# Altium schematic sheet Drive.SchDoc
size 420 x 297 mm; DocumentNumber: 2; SheetNumber: 11; SheetTotal: 14; PageSetup: Record=PageOptions|CenterHorizontal=True|CenterVertical=True|PrintScale=0.96|XCorrection=1.00|YCorrection=1.00|PrintKind=1|BorderSize=5000000|LeftOffset=0|BottomOffset=0|Orientation=2|PaperLength=4318|PaperWidth=2794|Scale=100|PaperSource=7|PrintQuality=600|MediaType=1|DitherType=10|PaperKind=11" x 17"|PrintScaleMode=1
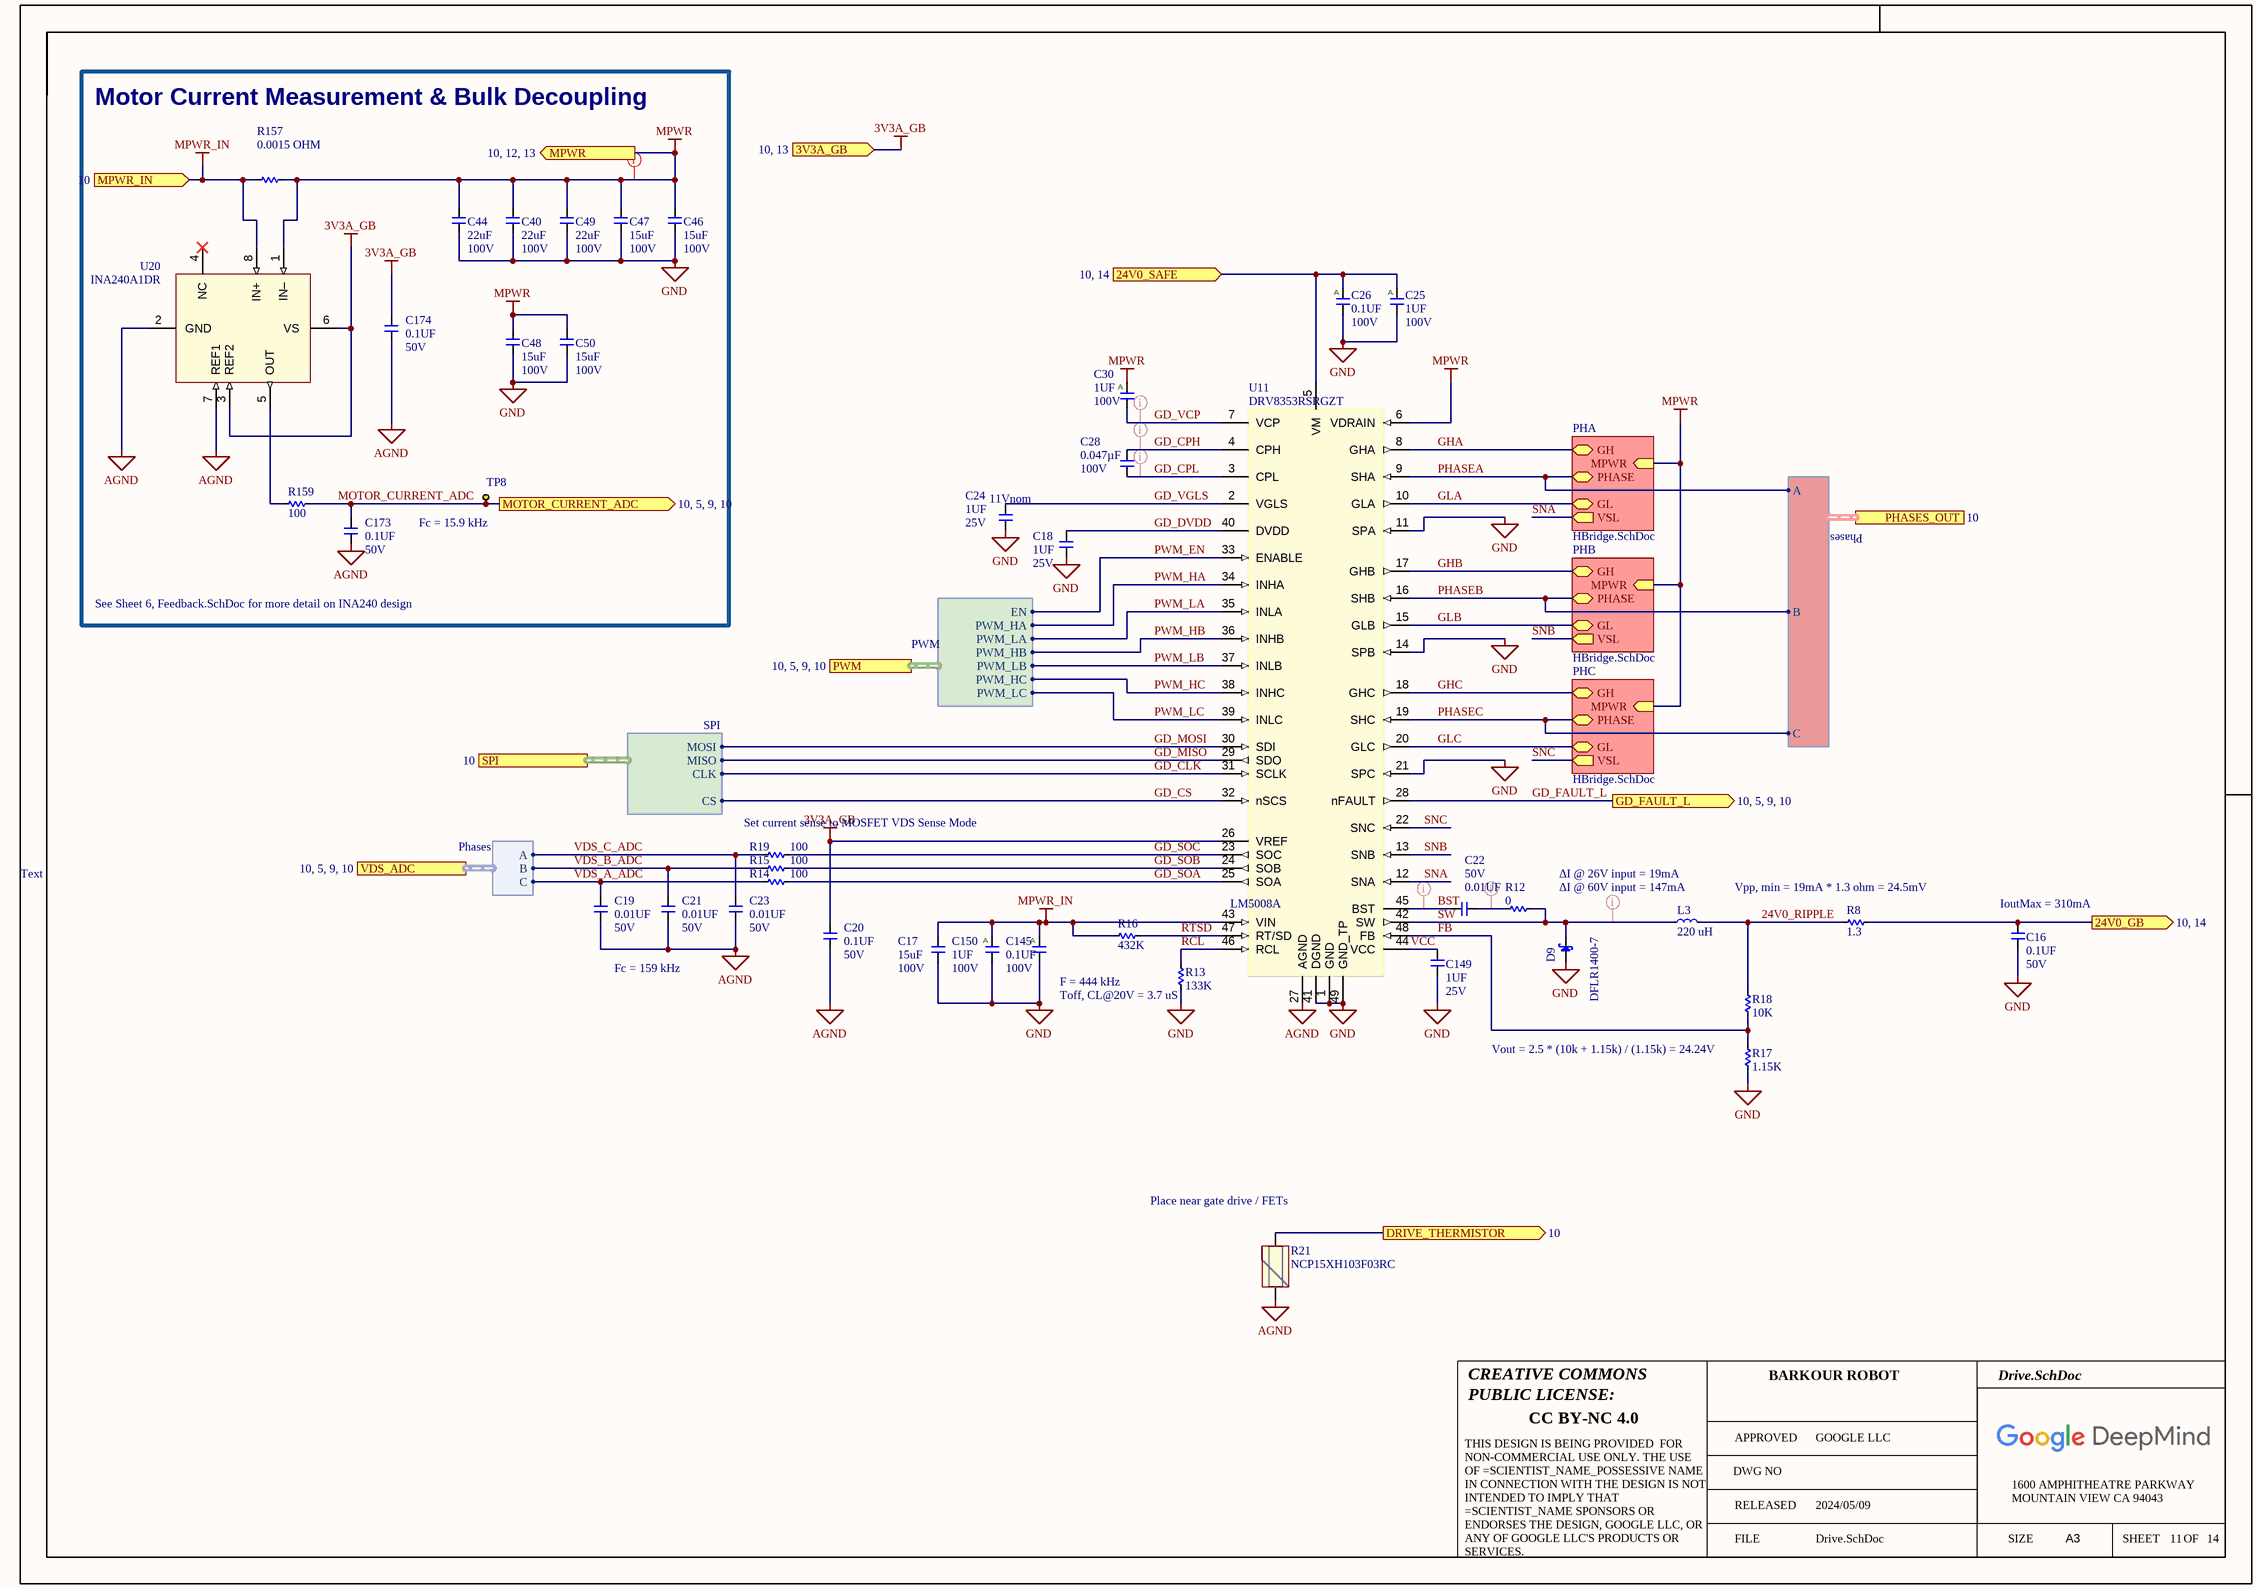
[diagram p0: Drive.SchDoc]

## Parts
C16  value 0.1UF  Voltage: 50V  [C0402]  (hidden comment: __Template_Cap)
C17  value 15uF  Voltage: 100V  [C2220]  (hidden comment: __Template_Cap)
C18  value 1UF  Voltage: 25V  [C0402]  (hidden comment: __Template_Cap)
C19  value 0.01UF  Voltage: 50V  [C0402]  (hidden comment: __Template_Cap)
C20  value 0.1UF  Voltage: 50V  [C0402]  (hidden comment: __Template_Cap)
C21  value 0.01UF  Voltage: 50V  [C0402]  (hidden comment: __Template_Cap)
C22  value 0.01UF  Voltage: 50V  [C0402]  (hidden comment: __Template_Cap)
C23  value 0.01UF  Voltage: 50V  [C0402]  (hidden comment: __Template_Cap)
C24  value 1UF  Voltage: 25V  [C0402]  (hidden comment: __Template_Cap)
C25  value 1UF  Voltage: 100V  [C0805]  (hidden comment: __Template_Cap_Auto)
C26  value 0.1UF  Voltage: 100V  [C0603]  (hidden comment: __Template_Cap_Auto)
C28  value 0.047µF  Voltage: 100V  [C0603]  (hidden comment: __Template_Cap)
C30  value 1UF  Voltage: 100V  [C0805]  (hidden comment: __Template_Cap_Auto)
C40  value 22uF  Voltage: 100V  [CAP_CKG57NX7S2A226M500JJ]  (hidden comment: __Template_Cap)
C44  value 22uF  Voltage: 100V  [CAP_CKG57NX7S2A226M500JJ]  (hidden comment: __Template_Cap)
C46  value 15uF  Voltage: 100V  [C2220]  (hidden comment: __Template_Cap)
C47  value 15uF  Voltage: 100V  [C2220]  (hidden comment: __Template_Cap)
C48  value 15uF  Voltage: 100V  [C2220]  (hidden comment: __Template_Cap)
C49  value 22uF  Voltage: 100V  [CAP_CKG57NX7S2A226M500JJ]  (hidden comment: __Template_Cap)
C50  value 15uF  Voltage: 100V  [C2220]  (hidden comment: __Template_Cap)
C145  value 0.1UF  Voltage: 100V  [C0603]  (hidden comment: __Template_Cap_Auto)
C149  value 1UF  Voltage: 25V  [C0402]  (hidden comment: __Template_Cap)
C150  value 1UF  Voltage: 100V  [C0805]  (hidden comment: __Template_Cap_Auto)
C173  value 0.1UF  Voltage: 50V  [C0402]  (hidden comment: __Template_Cap)
C174  value 0.1UF  Voltage: 50V  [C0402]  (hidden comment: __Template_Cap)
D9  value DFLR1400-7  [POWERDI123_DFLS1100-7]  (hidden comment: __Template_Diode_Schottky_A/K)
L3  value 220 uH  [IND_74404054221]  (hidden comment: __Template_Inductor)
R8  1.3  [R0805]
R12  0  [R0402]
R13  133K  [R0402]
R14  100  [R0402]
R15  100  [R0402]
R16  432K  [R0402]
R17  1.15K  [R0402]
R18  10K  [R0402]
R19  100  [R0402]
R21  Mfg P/N: NCP15XH103F03RC  [R0402]  (hidden comment: __Template_Thermistor)
R157  0.0015 OHM  [R2512]
R159  100  [R0402]
TP8  TEST_KEYSTONE5015  [TP_KEYSTONE_5015]  (value not drawn)
U11  MFG P/N: DRV8353RSRGZT  [VQFN50P700X700X100-48-TP_TP-CUST_NO_VIAS]  (hidden comment: MOTOR_DRIVE_DRV8353RSRGZT)
U20  INA240A1DR  [TI SOIC-8 D0008A]

## Blocks framed on the sheet
Motor Current Measurement & Bulk Decoupling: C40 C44 C46-C50 C173 C174 R157 R159 TP8 U20

## Sub-sheets
PHA = HBridge.SchDoc: GL (bidir), GH (bidir), PHASE (bidir), MPWR (in), VSL (out)
PHB = HBridge.SchDoc: GL (bidir), GH (bidir), PHASE (bidir), MPWR (in), VSL (out)
PHC = HBridge.SchDoc: GL (bidir), GH (bidir), PHASE (bidir), MPWR (in), VSL (out)

## Ports
3V3A_GB (in, see 10, 13), 24V0_GB (out, see 10, 14), 24V0_SAFE (in, see 10, 14), DRIVE_THERMISTOR (out, see 10), GD_FAULT_L (out, see 10, 5, 9, 10), MOTOR_CURRENT_ADC (out, see 10, 5, 9, 10), MPWR (out, see 10, 12, 13), MPWR_IN (in, see 10), PHASES_OUT (harness Phases, see 10), PWM (harness PWM, see 10, 5, 9, 10), SPI (harness SPI, see 10), VDS_ADC (harness Phases, see 10, 5, 9, 10)

## Harnesses
Phases: A, B, C
SPI: CLK, CS, MOSI, MISO
PWM: EN, PWM_HA, PWM_LA, PWM_HB, PWM_LB, PWM_HC, PWM_LC

## Nets
3V3A_GB: C20.1 C174.1 U11.26(VREF) U20.3(REF2) U20.6(VS) ; port 3V3A_GB
AGND: C19.2 C20.2 C21.2 C23.2 C173.2 C174.2 R21.2 U11.27(AGND) U20.2(GND) U20.7(REF1)
GND: C16.2 C17.2 C18.2 C24.2 C25.2 C26.2 C40.2 C44.2 C46.2 C47.2 C48.2 C49.2 C50.2 C145.2 C149.2 C150.2 D9.A R13.1 R17.1 U11.1(GND) U11.11(SPA) U11.14(SPB) U11.21(SPC) U11.41(DGND) U11.49(GND_TP)
MPWR: C30.1 C40.1 C44.1 C46.1 C47.1 C48.1 C49.1 C50.1 R157.2 U11.6(VDRAIN) U20.1(IN–) ; port MPWR, sheet PHA/MPWR, sheet PHB/MPWR, sheet PHC/MPWR
MPWR_IN: C17.1 C145.1 C150.1 R16.1 R157.1 U11.43(VIN) U20.8(IN+) ; port MPWR_IN
24V0_GB: C16.1 R8.2 ; port 24V0_GB
24V0_RIPPLE: L3.2 R8.1 R18.2
24V0_SAFE: C25.1 C26.1 U11.5(VM) ; port 24V0_SAFE
BST: C22.1 U11.45(BST)
DRIVE_THERMISTOR: R21.1 ; port DRIVE_THERMISTOR
FB: R17.2 R18.1 U11.48(FB)
GD_CLK: U11.31(SCLK) ; port SPI.CLK
GD_CPH: C28.1 U11.4(CPH)
GD_CPL: C28.2 U11.3(CPL)
GD_CS: U11.32(nSCS) ; port SPI.CS
GD_DVDD: C18.1 U11.40(DVDD)
GD_FAULT_L: U11.28(nFAULT) ; port GD_FAULT_L
GD_MISO: U11.29(SDO) ; port SPI.MISO
GD_MOSI: U11.30(SDI) ; port SPI.MOSI
GD_SOA: R14.2 U11.25(SOA)
GD_SOB: R15.2 U11.24(SOB)
GD_SOC: R19.2 U11.23(SOC)
GD_VCP: C30.2 U11.7(VCP)
GD_VGLS: C24.1 U11.2(VGLS)
GHA: U11.8(GHA) ; sheet PHA/GH
GHB: U11.17(GHB) ; sheet PHB/GH
GHC: U11.18(GHC) ; sheet PHC/GH
GLA: U11.10(GLA) ; sheet PHA/GL
GLB: U11.15(GLB) ; sheet PHB/GL
GLC: U11.20(GLC) ; sheet PHC/GL
MOTOR_CURRENT_ADC: C173.1 R159.2 TP8.1 ; port MOTOR_CURRENT_ADC
PHASEA: U11.9(SHA) ; sheet PHA/PHASE, port PHASES_OUT.A
PHASEB: U11.16(SHB) ; sheet PHB/PHASE, port PHASES_OUT.B
PHASEC: U11.19(SHC) ; sheet PHC/PHASE, port PHASES_OUT.C
PWM_EN: U11.33(ENABLE) ; port PWM.EN
PWM_HA: U11.34(INHA) ; port PWM.PWM_HA
PWM_HB: U11.36(INHB) ; port PWM.PWM_HB
PWM_HC: U11.38(INHC) ; port PWM.PWM_HC
PWM_LA: U11.35(INLA) ; port PWM.PWM_LA
PWM_LB: U11.37(INLB) ; port PWM.PWM_LB
PWM_LC: U11.39(INLC) ; port PWM.PWM_LC
RCL: R13.2 U11.46(RCL)
RTSD: R16.2 U11.47(RT/SD)
SNA: U11.12(SNA) ; sheet PHA/VSL
SNB: U11.13(SNB) ; sheet PHB/VSL
SNC: U11.22(SNC) ; sheet PHC/VSL
SW: D9.K L3.1 R12.2 U11.42(SW)
VCC: C149.1 U11.44(VCC)
VDS_A_ADC: C19.1 R14.1 ; port VDS_ADC.C
VDS_B_ADC: C21.1 R15.1 ; port VDS_ADC.B
VDS_C_ADC: C23.1 R19.1 ; port VDS_ADC.A
NetC22_2: C22.2 R12.1
NetR159_1: R159.1 U20.5(OUT)

Not connected (* = marked no-connect by the designer): U20 4(NC)*

## Layout directives
net class HVSW: BST, GD_CPH, GD_CPL, GD_VCP, NetC22_2, SW
net class HV: MPWR

## Notes on the sheet
- (near TP8) Fc = 15.9 kHz
- 11Vnom
- See Sheet 6, Feedback.SchDoc for more detail on INA240 design
- (near U11) Set current sense to MOSFET VDS Sense Mode
- Text
- (near U11) LM5008A
- ΔI @ 26V input = 19mA
- ΔI @ 60V input = 147mA
- (near R8) Vpp, min = 19mA * 1.3 ohm = 24.5mV
- IoutMax = 310mA
- Fc = 159 kHz
- F = 444 kHz
- (near R13) Toff, CL@20V = 3.7 uS
- (near R17) Vout = 2.5 * (10k + 1.15k) / (1.15k) = 24.24V
- (near R21) Place near gate drive / FETs
- CREATIVE COMMONS
- PUBLIC LICENSE:
- BARKOUR ROBOT
- CC BY-NC 4.0
- APPROVED
- DWG NO
- GOOGLE LLC
- FILE
- RELEASED
- 2024/05/09
- SIZE
- 1600 AMPHITHEATRE PARKWAY
- MOUNTAIN VIEW CA 94043
- A3
- SHEET
- OF
- THIS DESIGN IS BEING PROVIDED  FOR NON-COMMERCIAL USE ONLY. THE USE OF =SCIENTIST_NAME_POSSESSIVE NAME IN CONNECTION WITH THE DESIGN IS NOT INTENDED TO IMPLY THAT =SCIENTIST_NAME SPONSORS OR ENDORSES THE DESIGN, GOOGLE LLC, OR ANY OF GOOGLE LLC'S PRODUCTS OR SERVICES.
- (in symbol 1039) A
- (in symbol 1093) A

## Library data of the parts
C16 C20 C173 C174 = 1762: CAP, CER, X5R, 0.1uF, 10%, 50V, 0402, 0.55mm; MFG: YAGEO; MFG P/N: CC0402KRX5R9BB104; Status: Released; Package: 0402; Supplier 1: Digi-Key; ComponentLink1URL: http://www.yageo.com/documents/recent/UPY-GPHC_X5R_4V-to-50V_25.pdf; Supplier Part Number 1: 311-3342-1-ND
C17 C46-C48 C50 = 207: CAP, CER, X7S, 15uF, 100V, 20%, 2220, 2.8mm T; MFG: TDK; MFG P/N: CKG57KX7S2A156M335JH; Status: Released; Package: 2220; Supplier 1: Mouser; ComponentLink1URL: https://www.mouser.com/ProductDetail/TDK/CKG57KX7S2A156M335JH?qs=xLDY6iXSiQZjzyWjP57ZVA%3D%3D; Supplier Part Number 1: 810-CKG57KX7S2A156MH
C18 C24 C149 = 1717: CAP, CER, X5R, 1uF, 10%, 25V, 0402; MFG: TDK; MFG P/N: C1005X5R1E105K050BC; COMMON: 150-01202-00; Status: Released; Package: 0402; Supplier 1: Digi-Key; ComponentLink1URL: https://product.tdk.com/info/en/catalog/datasheets/mlcc_commercial_general_en.pdf; Supplier Part Number 1: 445-9066-1-ND
C19 C21-C23 = 625: CAP, CER, X7R, 0.01uF, 50V, 20%, 0402, 0.56mm T; MFG: KEMET; MFG P/N: C0402C103M5RACTU; COMMON: 150-00227-00; Status: Released; Package: 0402; Supplier 1: Digi-Key; ComponentLink1URL: https://www.digikey.com/en/products/detail/kemet/C0402C103M5RAC7867/2196227; Supplier Part Number 1: 399-C0402C103M5RAC7867CT-ND
C25 C30 C150 = 1093: CAP, CER, X7S, 1uF, 20%, 100V, 0805; MFG: TDK; MFG P/N: CGA4J3X7S2A105M125AE; COMMON: 150-01093-00; Status: Released; Package: 0805; Supplier 1: Digi-Key; ComponentLink1URL: https://www.digikey.com/en/products/detail/tdk-corporation/CGA4J3X7S2A105M125AE/2782484; Supplier Part Number 1: 445-7961-1-ND
C26 C145 = 1039: CAP, CER, X7S, 0.1uF, 100V, 10%, 0603, AUTOGRADE; MFG: TDK; MFG P/N: CGA3E3X7S2A104K080AB; COMMON: 150-00222-00; Status: Released; Package: 0603; Supplier 1: Digi-Key; ComponentLink1URL: https://www.digikey.com/en/products/detail/tdk-corporation/CGA3E3X7S2A104K080AB/2672831; Supplier Part Number 1: 445-6938-1-ND
C28 = 1838: CAP, CER, X7R, 0.047uF, 100V, 10%, 0603, AUTOGRADE; MFG: Samsung Electro-Mechanics; MFG P/N: CL10B473KC8WPNC; Status: Released; Package: 0603; Supplier 1: Mouser; ComponentLink1URL: https://www.mouser.com/ProductDetail/Samsung-Electro-Mechanics/CL10B473KC8WPNC?qs=xZ%2FP%252Ba9zWqZHK%252B26%2FNJNOA%3D%3D; Supplier Part Number 1: 87-CL10B473KC8WPNC
C40 C44 C49 = 207: CAP CER 22UF 100V X7S SMD (6.00mm x 5.00mm x 5.5mm); MFG: TDK; MFG P/N: CKG57NX7S2A226M500JJ; Status: Released; Supplier 1: Digi-Key; ComponentLink1URL: https://www.mouser.com/ProductDetail/TDK/CKG57KX7S2A156M335JH?qs=xLDY6iXSiQZjzyWjP57ZVA%3D%3D; Supplier Part Number 1: 445-10513-1-ND
D9 = 203: DIODE, SCHOTTKY, 100V, 1A, POWERDI123; MFG: Diodes Incorporated; Status: Released; MFG P/N: DFLR1400-7; Package: POWERDI®123; Supplier 1: Digi-Key; ComponentLink1URL: https://www.digikey.com/en/products/detail/diodes-incorporated/DFLR1400-7/776775; Supplier Part Number 1: DFLR1400DICT-ND
L3 = 938: 220 µH Semi-Shielded Drum Core, Wirewound Inductor 500 mA 1.4Ohm Nonstandard; MFG: Würth Elektronik; MFG P/N: 74404054221; Status: Released; Package: 2 - pin SMD; Supplier 1: Digi-Key; ComponentLink1URL: https://www.coilcraft.com/en-us/products/power/shielded-inductors/ferrite-drum/mss-mos/mss7348/#; Supplier Part Number 1: 732-11722-1-ND
R8 = 8516: RES, 1.3, 1%, 1/2W, AUTOGRADE, 0805; MFG: Panasonic Electronic Components; MFG P/N: ERJ-6DQF1R3V; Status: Released; Package: 0805; Value: 1.3; Supplier 1: Digi-Key; ComponentLink1URL: https://industrial.panasonic.com/cdbs/www-data/pdf/RDN0000/AOA0000C313.pdf; Supplier Part Number 1: P19271CT-ND
R12 = 8004: RES, 0, JUMPER, 1/16W, 0402; MFG: YAGEO; MFG P/N: RC0402FR-070RL; COMMON: 470-02332-00; Status: Released; Package: 0402; Value: 0; Supplier 1: Digi-Key; ComponentLink1URL: https://www.digikey.com/en/products/detail/yageo/RC0402FR-070RL/2827570; Supplier Part Number 1: 311-0.0LRCT-ND
R13 = 5074: RES, 133K, 1%, 1/16W, 0402, AUTOGRADE; MFG: VISHAY; MFG P/N: CRCW0402133KFKED; COMMON: 470-02579-00; Status: Released; Package: 0402; Value: 133K; Supplier 1: Digi-Key; ComponentLink1URL: https://www.digikey.com/en/products/detail/vishay-dale/CRCW0402133KFKED/1178248; Supplier Part Number 1: 541-133KLCT-ND
R14 R15 R19 R159 = 7286: RES, 100, 1%, 1/10W, 0402, AUTO GRADE; MFG: PANASONIC; MFG P/N: ERJ2RKF1000X; COMMON: 470-00294-00; Status: Released; Package: 0402; Value: 100; Supplier 1: Digi-Key; ComponentLink1URL: https://www.digikey.com/en/products/detail/panasonic-electronic-components/ERJ-2RKF1000X/192080; Supplier Part Number 1: P100LCT-ND
R16 = 8801: RES, 432K, 1%, 1/16W, 0402; MFG: VISHAY; MFG P/N: CRCW0402432KFKED; Status: Released; Package: 0402; Value: 432K; Supplier 1: Digi-Key; ComponentLink1URL: http://www.vishay.com/docs/28773/crcwce3.pdf; Supplier Part Number 1: 541-432KLCT-ND
R17 = 8684: RES, 1.15K, 1%, 1/16W, 0402; MFG: VISHAY; MFG P/N: CRCW04021K15FKED; Status: Released; Package: 0402; Value: 1.15K; Supplier 1: Digi-Key; ComponentLink1URL: http://www.vishay.com/docs/28773/crcwce3.pdf; Supplier Part Number 1: 541-1.15KLCT-ND
R18 = 7216: RES, 10K, 1%, 1/10W, 0402, AUTOGRADE; MFG: PANASONIC; MFG P/N: ERJ2RKF1002X; COMMON: 470-00319-00; Status: Released; Package: 0402; Value: 10K; Supplier 1: Digi-Key; ComponentLink1URL: https://www.digikey.com/en/products/detail/panasonic-electronic-components/ERJ-2RKF1002X/192073; Supplier Part Number 1: P10.0KLCT-ND
R21 = 175: SENSOR, THERMISTOR, NTC, 10K, 1%, 3380K, 100mW, 0402; Mfg: Murata Electronics; Value: 10KOHM; Status: Released; Package: 0402; Supplier 1: Digi-Key; ComponentLink1URL: https://www.murata.com/en-us/api/pdfdownloadapi?cate=&partno=NCP15XH103F03RC; Supplier Part Number 1: 490-4801-1-ND
R157 = 9999: RES, 0.0015, 1%, 3W, 2512; MFG: TE Connectivity Passive Product; MFG P/N: TLR3A30DR0015FTDG; Status: Released; Package: 2512; Value: 0.0015 OHM; Supplier 1: Digi-Key; ComponentLink1URL: https://www.te.com/commerce/DocumentDelivery/DDEController?Action=srchrtrv&DocNm=1773449-3&DocType=DS&DocLang=English; Supplier Part Number 1: A131795CT-ND
TP8 = TEST_KEYSTONE5015: PC TEST POINT MINIATURE SMT; MFG: Keystone Electronics; MFG P/N: 5015; Value: 5015; COMMON: 250-00207-00; Supplier 1: Digi-Key; ComponentLink1URL: http://mail.keyelco.com/ENG._DEPT/PDF%20CAT%20NO%20Drawings/5015.pdf; Supplier Part Number 1: 36-5015CT-ND; Status: In Development
U11 = 820: IC, MOTOR DRIVER, DRV8353, MULTIPHASE, BLDC, HALF BRIDGE, POWER MOSFET, 6V TO 95V VIN, VQFN-48; MFG: Texas Instruments; Status: Released; Package: 48-VQFN (7x7); Supplier 1: Digi-Key; ComponentLink1URL: https://www.ti.com/lit/ds/symlink/drv8350.pdf?HQS=TI-null-null-digikeymode-df-pf-null-wwe&ts=1593096373926; Supplier Part Number 1: 296-50273-1-ND; Value: DRV8353RSRGZT
U20 = INA240A1: Current Sense Amplifiers -4 to 80V, bidirectional, ultra-precise current sense amplifier with enhanced PWM rejection, 20V/V gain; MFG: Texas Instruments; Supplier 1: Digi-Key; Supplier Part Number 1: 296-51172-1-ND; ComponentLink1URL: https://www.digikey.com/en/products/detail/texas-instruments/INA240A1DR/8538109; MFG P/N: INA240A1DR; Value: INA240A1DR